# Altium schematic sheet Ethernet.SchDoc
size B
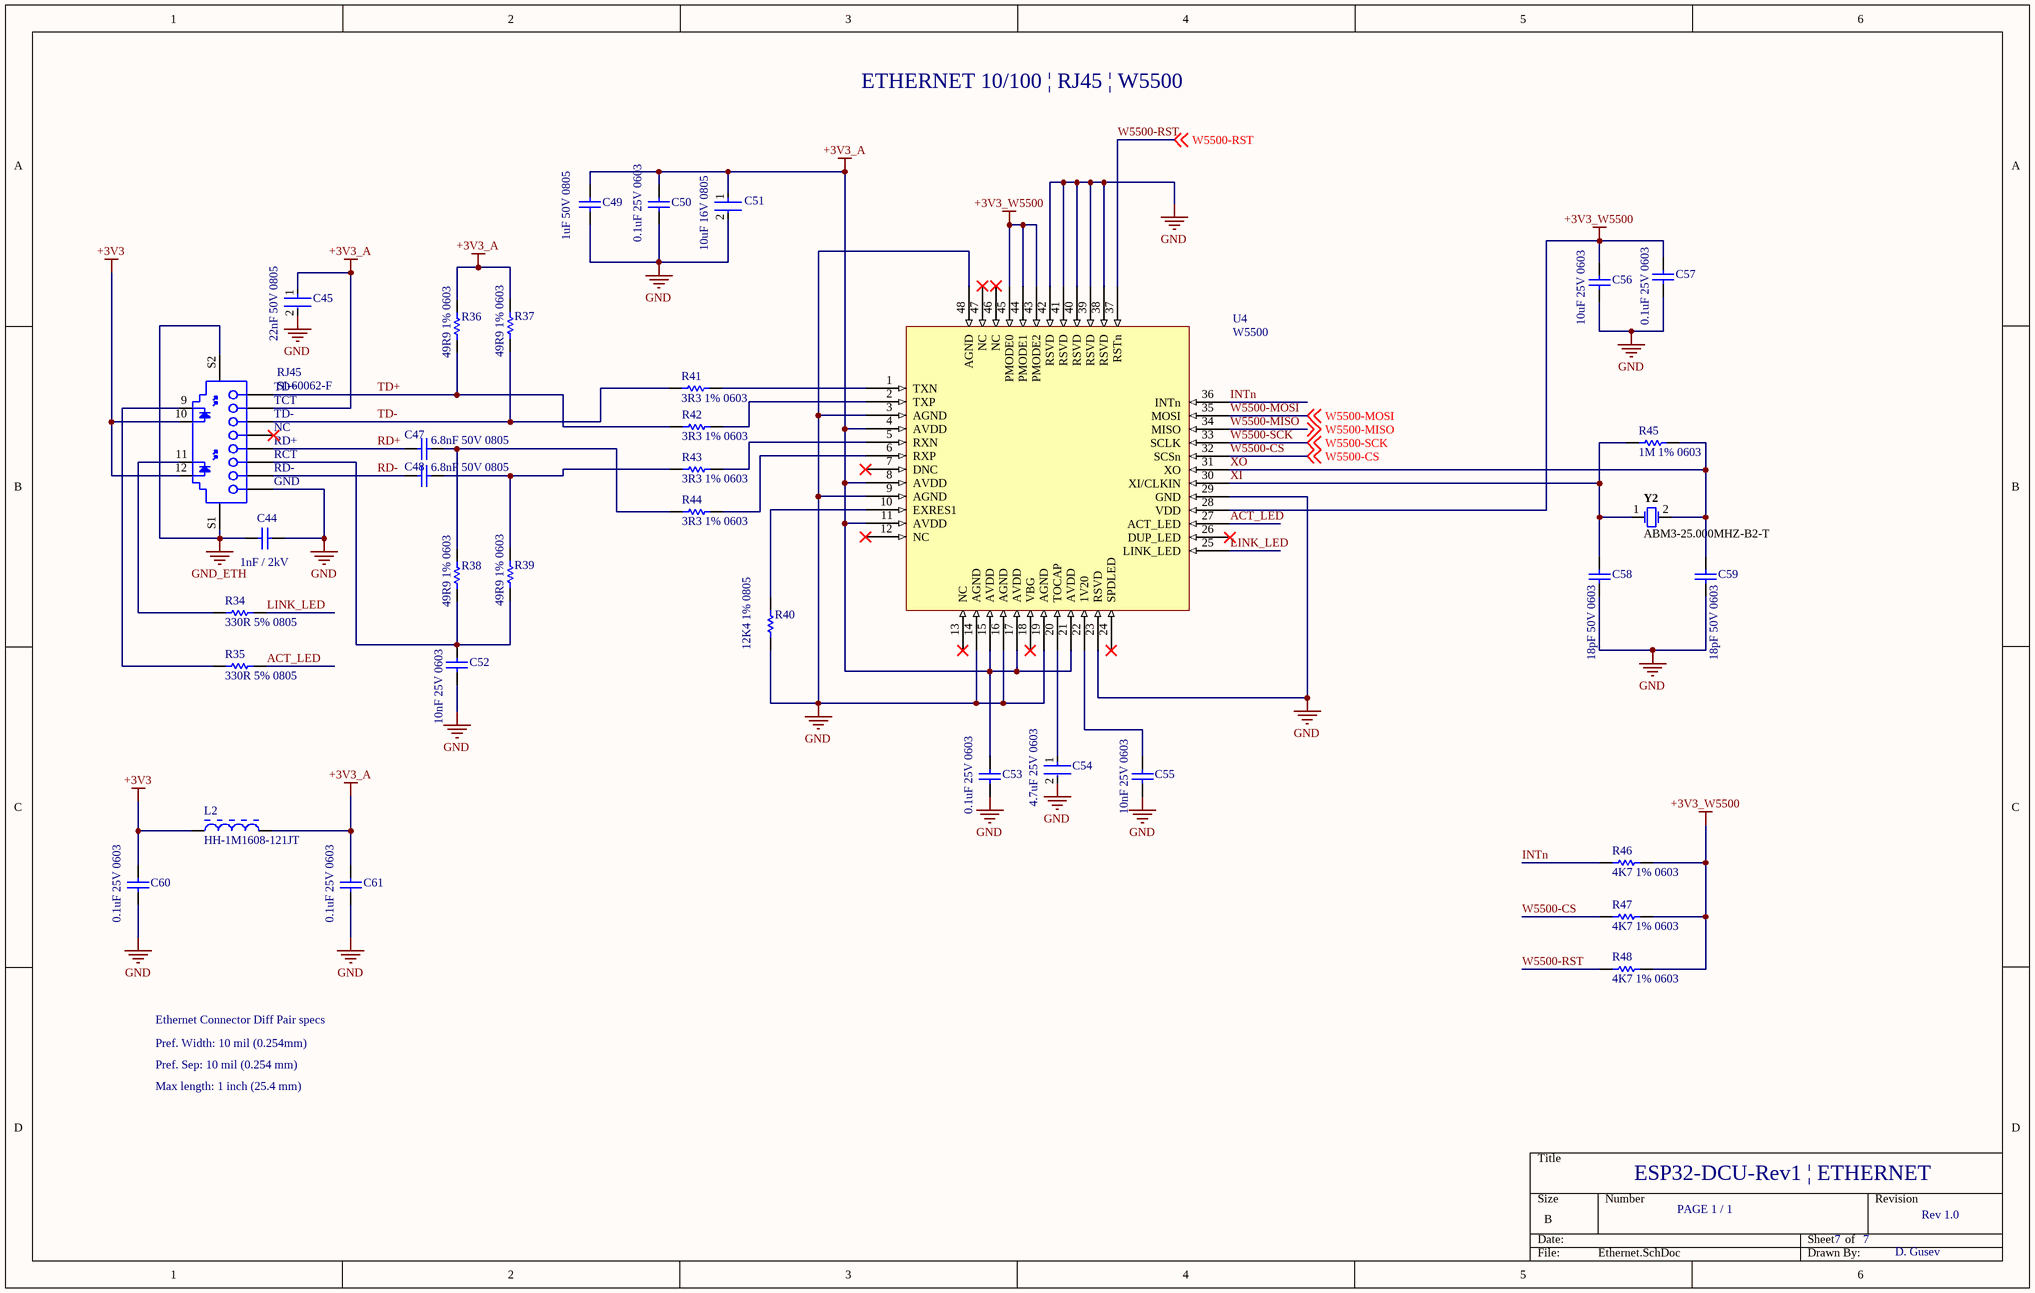
[diagram p0: Ethernet.SchDoc]

## Parts
C44  1nF / 2kV  [CAPC4532X155X60LL30T35]
C45  22nF 50V 0805  [FP-CL21-IPC_A]
C47  6.8nF 50V 0805  [CAPC2013X94X50NL20T25]
C48  6.8nF 50V 0805  [CAPC2013X94X50NL20T25]
C49  1uF 50V 0805  [CAPC2013X135X45LL10T25]
C50  0.1uF 25V 0603  [CAPC1608X90X35LL10T15]
C51  10uF 16V 0805  [FP-GRM21B-0_1-IPC_C]
C52  10nF 25V 0603  [CAPC1608X90X35NL15T15]
C53  0.1uF 25V 0603  [CAPC1608X90X35LL10T15]
C54  4.7uF 25V 0603  [FP-GRM188-0_15-IPC_C]
C55  10nF 25V 0603  [CAPC1608X90X35NL15T15]
C56  10uF 25V 0603  [CAPC1608X100X20VL10T10]
C57  0.1uF 25V 0603  [CAPC1608X90X35LL10T15]
C58  18pF 50V 0603  [CAPC1608X90X40LL10T20]
C59  18pF 50V 0603  [CAPC1608X90X40LL10T20]
C60  0.1uF 25V 0603  [CAPC1608X90X35LL10T15]
C61  0.1uF 25V 0603  [CAPC1608X90X35LL10T15]
L2  HH-1M1608-121JT  [CTC-1608_L]
R34  330R 5% 0805  [RESC2013X60X35LL10T20]
R35  330R 5% 0805  [RESC2013X60X35LL10T20]
R36  49R9 1% 0603  [RESC1608X55X25NL10T15]
R37  49R9 1% 0603  [RESC1608X55X25NL10T15]
R38  49R9 1% 0603  [RESC1608X55X25NL10T15]
R39  49R9 1% 0603  [RESC1608X55X25NL10T15]
R40  12K4 1% 0805  [RESC2013X60X35NL10T20]
R41  3R3 1% 0603  [RESC1608X55X25ML10T15]
R42  3R3 1% 0603  [RESC1608X55X25ML10T15]
R43  3R3 1% 0603  [RESC1608X55X25ML10T15]
R44  3R3 1% 0603  [RESC1608X55X25ML10T15]
R45  1M 1% 0603  [RESC1608X55X25LL10T15]
R46  4K7 1% 0603  [RESC1608X55X25LL10T15]
R47  4K7 1% 0603  [RESC1608X55X25LL10T15]
R48  4K7 1% 0603  [RESC1608X55X25LL10T15]
RJ45  SI-60062-F  [BELF-SI-60062-F_V]
U4  W5500  [W5500]
Y2  ABM3-25.000MHZ-B2-T  [ABRA-ABM3_V]

## Nets
+3V3: C60.2 L2.1 RJ45.10 RJ45.12
+3V3_A: C45.1 C49.2 C50.2 C51.1 C53.2 C61.2 L2.2 R36.2 R37.2 RJ45.2(TCT) U4.4(AVDD) U4.8(AVDD) U4.11(AVDD) U4.15(AVDD) U4.17(AVDD) U4.21(AVDD)
+3V3_W5500: C56.2 C57.2 R46.2 R47.2 R48.2 U4.28(VDD) U4.43(PMODE2) U4.44(PMODE1) U4.45(PMODE0)
GND: C44.2 C45.2 C49.1 C50.1 C51.2 C52.1 C53.1 C54.2 C55.1 C56.1 C57.1 C58.1 C59.1 C60.1 C61.1 R40.1 RJ45.8(GND) U4.3(AGND) U4.9(AGND) U4.14(AGND) U4.16(AGND) U4.19(AGND) U4.23(RSVD) U4.29(GND) U4.38(RSVD) U4.39(RSVD) U4.40(RSVD) U4.41(RSVD) U4.42(RSVD) U4.48(AGND)
GND_ETH: C44.1 RJ45.S1 RJ45.S2
ACT_LED: R35.2 U4.27(ACT_LED)
INTn: R46.1 U4.36(INTn)
LINK_LED: R34.2 U4.25(LINK_LED)
RD+: C47.1 RJ45.5(RD+)
RD-: C48.1 RJ45.7(RD-)
TD+: R36.1 R42.1 RJ45.1(TD+)
TD-: R37.1 R41.1 RJ45.3(TD-)
W5500-CS: R47.1 U4.32(SCSn) ; off-sheet W5500-CS
W5500-MISO: U4.34(MISO) ; off-sheet W5500-MISO
W5500-MOSI: U4.35(MOSI) ; off-sheet W5500-MOSI
W5500-RST: R48.1 U4.37(RSTn) ; off-sheet W5500-RST
W5500-SCK: U4.33(SCLK) ; off-sheet W5500-SCK
XI: C58.2 R45.1 U4.30(XI/CLKIN) Y2.1
XO: C59.2 R45.2 U4.31(XO) Y2.2
NetC47_2: C47.2 R38.2 R44.1
NetC48_2: C48.2 R39.2 R43.1
NetC52_2: C52.2 R38.1 R39.1 RJ45.6(RCT)
NetC54_1: C54.1 U4.20(TOCAP)
NetC55_2: C55.2 U4.22(1V20)
NetR34_1: R34.1 RJ45.11
NetR35_1: R35.1 RJ45.9
NetR40_2: R40.2 U4.10(EXRES1)
NetR41_2: R41.2 U4.1(TXN)
NetR42_2: R42.2 U4.2(TXP)
NetR43_2: R43.2 U4.5(RXN)
NetR44_2: R44.2 U4.6(RXP)

Not connected (* = marked no-connect by the designer): RJ45 4(NC)*; U4 7(DNC)* 12(NC)* 13(NC)* 18(VBG)* 24(SPDLED)* 26(DUP_LED)* 46(NC)* 47(NC)*

## Notes on the sheet
- ETHERNET 10/100 | RJ45 | W5500
- Ethernet Connector Diff Pair specs
- Pref. Width: 10 mil (0.254mm)
- Pref. Sep: 10 mil (0.254 mm)
- Max length: 1 inch (25.4 mm)
- ESP32-DCU-Rev1 | ETHERNET
- PAGE 1 / 1
- 7
- Rev 1.0
- D. Gusev

## Library data of the parts
C44 = CMP-2000-06032-1: Chip Capacitor, 1000 pF, +/- 10%, 2000 V, -55 to 125 degC, 1812 (4532 Metric), RoHS, Tape and Reel; Manufacturer: Kemet; Kits: 399-5086-ND-KITCERHI-VOLTAGECAPS; Catalog Drawings: ACTU_1812; Capacitance: 1000pF; Product Training Modules: CapacitorBasics-TypicalUsesforCapacitors; Online Catalog: X7RDielectricHighVoltage; Other Names: 399-3447-1; Temperature Coefficient: X7R; Voltage - Rated: 2000V(2kV); Family: CeramicCapacitors; Height - Seated (Max): -; Standard Package: 1; Size / Dimension: 0.177"Lx0.126"W(4.50mmx3.20mm); Datasheet URL: http://capacitoredge.kemet.com/capedge2/DataSheet/Datasheet-C1812C102KGRACTU.pdf?pn=C1812C102KGRACTU; Datasheet Version: 09/2016; Thickness (Max): 0.061"(1.55mm); Applications: SMPSFiltering; Package Description: 2-Pin Surface Mount Device, Body 4.5 x 3.2 mm; Package Reference: 1812; Mounting Technology: SurfaceMount; Packaging: CutTape(CT); Manufacturer URL: http://www.kemet.com/; Operating Temperature: -55°C~125°C; Mounting Type: SurfaceMount,MLCC; Features: HighVoltage; Package / Case: 1812(4532Metric); Lead Spacing: -; Tolerance: ±10%; Lead Style: -; Series: C; Category: Capacitors; Ratings: -
C45 = CMP-13271-002911-1: CL21 Series 0805 22nF 50V ±10% Tolerance X7R Multilayer Ceramic Chip Capacitor; Depth: 1.25mm; Thickness: 0.03inch; Height: 0.65mm; Material: Ceramic; Case/Package: 0805; Voltage Rating (DC): 50V; Contact Plating: Tin; Package Quantity: 1; Case Code (Metric): 2012; Max Operating Temperature: 125°C; Packaging: Tape and Reel; Voltage Rating: 50V; Radiation Hardening: No; Length: 2mm; Mount: Surface Mount; Min Operating Temperature: -55°C; Tolerance: 10%; Case Code (Imperial): 0805; Voltage: 50V; Capacitance: 22nF; Dielectric: X7R; Lead Free: Lead Free; Width: 0.049inch
C47 C48 = CMP-1036-03710-2: Manufacturer: AVX Interconnect / Elco; Part Number: 08055C682KAT2A
C49 = CMP-1036-04761-2: Manufacturer: Murata; Part Number: GRM21BR71H105KA12L
C50 C53 C57 C60 C61 = CMP-2006-02868-1: Part Number: GRM188R71E104KA01D; Manufacturer: Murata
C51 = CMP-2007-03453-2: Chip Multilayer Ceramic Capacitors for General Purpose, 0805, 10uF, X5R, 15%, 10%, 16V; Radiation Hardening: No; Thickness: 0.053inch; Voltage Rating (DC): 16V; Lead Free: Lead Free; Package Quantity: 1; Width: 1.25mm; Case Code (Imperial): 0805; Depth: 1.25mm; Packaging: Tape and Reel; Dielectric: X5R; Max Operating Temperature: 85°C; Tolerance: 10%; Voltage Rating: 16V; Voltage: 16V; Capacitance: 10uF; Height: 1.25mm; Case Code (Metric): 2012; Material: Ceramic; Mount: Surface Mount; Case/Package: 0805; REACH SVHC: No SVHC; Length: 2mm; Min Operating Temperature: -55°C; Termination: SMD/SMT
C52 C55 = CMP-2006-04155-1: Part Number: 06033C103KAT2A; Manufacturer: AVX Interconnect / Elco
C54 = CMP-2006-02523-2: Chip Multilayer Ceramic Capacitors for General Purpose, 0603, 4.7uF, X5R, 15%, 10%, 25V; Case Code (Metric): 1608; Max Operating Temperature: 85°C; REACH SVHC: No SVHC; Voltage Rating: 25V; Dielectric: X5R; Packaging: Cut Tape; Width: 0.031inch; Min Operating Temperature: -55°C; Lead Free: Lead Free; Capacitance: 4.7uF; Height: 0.8mm; Case Code (Imperial): 0603; Length: 1.6mm; Voltage Rating (DC): 25V; Case/Package: 0603; Voltage: 25V; Tolerance: 10%; Thickness: 0.031inch; Mount: Surface Mount; Material: Ceramic; Package Quantity: 4000; Depth: 0.8mm
C56 = CMP-2000-05442-1: Chip Capacitor, 10 uF, +/- 20%, 25 V, -55 to 85 degC, 0603 (1608 Metric), RoHS, Tape and Reel; Manufacturer: TDK; PCN Part Number: MLCCPartNumberChange30/Nov/2012; Other Names: 445-9015-1; Capacitance: 10µF; Design Resources: 20WNon-IsolatedBuckLEDDriverUsingPLLNK460KG; Kits: 445-9014-KIT-ND-KITMLCC100PF-22UF060310-50V; Product Training Modules: SEAT,CCV,andTVCLDesignToolsGuidetoReplacinganElectrolyticCapacitorwithanMLCC; Online Catalog: CSeries,GeneralPurpose; Temperature Coefficient: X5R; Package Description: 2-Pin Surface Mount Device, Body 1.6 x 0.8 mm; Lead Style: -; Datasheet URL: http://download.siliconexpert.com/pdfs/2016/2/22/9/40/35/949/tdk_/manual/8010476609961980104703407078c1608x5r1e106m080ac.pdf.pdf; Category: Capacitors; Package / Case: 0603(1608Metric); Packaging: CutTape(CT); Series: C; Features: -; Family: CeramicCapacitors; Standard Package: 1; Tolerance: ±20%; Operating Temperature: -55degC~85degC; Mounting Type: SurfaceMount,MLCC; Ratings: -; Size / Dimension: 0.063"Lx0.031"W(1.60mmx0.80mm); Applications: GeneralPurpose; Package Reference: 1608; RoHS Information: RoHSCertificate-MLCC; Manufacturer URL: http://www.tdk.com/; Datasheet Version: Feb-16; Voltage - Rated: 25V; Height - Seated (Max): -; Thickness (Max): 0.039"(1.00mm); Lead Spacing: -
C58 C59 = CMP-1659-00030-1: Chip Capacitor, 18 pF, +/- 5%, 50 V, -55 to 125 degC, 0603 (1608 Metric), RoHS, Tape and Reel; Case\Package: 0603; Power Rating: 100 mW; Resistance: 68.1 Ohm; Tolerance: 1%; Case Code (Metric): 1608; Max Operating Temperature: 155 degC; RoHSCompliant: true; Case Code (Imperial): 0603; Voltage Rating: 50 V; ComponentLink2Description: Datasheet; Package Quantity: 200; PackageReference: 0603; ComponentLink2URL: http://www.yageo.com/NewPortal/yageodocoutput?fileName=/pdf/MLCC/UPY-GP_NP0_16V-to-50V_14.pdf; Length: 1.6 mm; DatasheetVersion: Rev. 14, 07/2016; Min Operating Temperature: -55 degC; ComponentLink1URL: http://www.yageo.com/; Width: 0.8 mm; ComponentLink1Description: Manufacturer URL; Height: 0.45 mm; Radiation Hardening: No; PackageDescription: 2-Pin Surface Mount Device, Body 1.6 x 0.8 mm; Packaging: Tape and Reel
L2 = CMP-2000-06403-1: Chip Ferrite Bead, 0.14 Ohm, 1.1 A, -55 to 125 degC, 2-Pin SMD, RoHS, Tape and Reel; Manufacturer: CTC Coils; DC Resistance Max: 140MOhm; DC Current Max: 1.1A; Datasheet Version: 07/2004; Datasheet URL: http://data.icbank.com/ICBShop/board/beadhbm.pdf; PartNumber: HH-1M1608; Package Reference: 1608; Temperature Min: -55degC; Manufacturer URL: http://www.brokerforum.com/components-parts/CTCCoils-e-en.jsa; Mounting Technology: SurfaceMount; Temperature Max: 125degC; Package Description: 2-Pin Surface Mount Device, Body 1.6 x 0.8 mm; Packing: TapeandReel
R34 R35 = CMP-2000-06960-1: Chip Resistor, 330 Ohm, +/- 1%, 125 mW, -55 to 155 degC, 0805 (2012 Metric), RoHS, Tape and Reel; Manufacturer: Yageo; Voltage Rating: 150V; Temperature Coefficient: 100PPM/C; Power Rating: 125mW(1/8W); Resistance: 330Ohms; Datasheet Version: Rev. 7, 05/2017; Termination Style: SMD/SMT; Case Code - mm: 2012; Package Description: 2-Pin Surface Mounted Device, Body 2 x 1.25 mm; Operating Temperature Range: -55Cto+155C; Case Code - in: 0805; Packaging: Reel; Tolerance: 1%; Package Reference: 0805; Mounting Technology: SurfaceMount; Product: ThickFilmResistorsGeneralPurpose; Series: RC; Manufacturer URL: http://www.yageo.com/; Datasheet URL: http://www.yageo.com/documents/recent/PYu-RC_Group_51_RoHS_L_7.pdf
R36-R39 = CMP-1659-00036-1: General Purpose Chip Resistor, 49.9 Ohm, +/- 1%, -55 to 155 degC, 0603 (1608 Metric), RoHS, Tape and Reel; Max Supply Voltage: 3.63 V; Case\Package: LQFP; Interface: SPI; Min Supply Voltage: 2.97 V; PackageReference: 0603; Packaging: Tray; ComponentLink2Description: Datasheet; ComponentLink1Description: Manufacturer URL; ComponentLink2URL: https://datasheet.ciiva.com/11808/0900766b80f96399-11808223.pdf; RoHSCompliant: true; Max Operating Temperature: 85 degC; ComponentLink1URL: http://www.yageo.com/; PackageDescription: 2-Pin Surface Mount Device, Body 1.6 x 0.8 mm; DatasheetVersion: Rev. 4, 04/2009; Min Operating Temperature: -40 degC; Package Quantity: 250; Pins: 48
R40 = CMP-2001-00911-1: Part Number: RC0805FR-0712K4L; Manufacturer: Yageo
R41-R44 = CMP-2000-04272-1: Part Number: RC0603JR-073R3L; Manufacturer: Yageo
R45 = CMP-2000-04829-1: Manufacturer: Yageo; Part Number: AC0603FR-071ML
R46-R48 = CMP-2000-06942-1: Chip Resistor, 4.7 KOhm, +/- 1%, 0.1 W, -55 to 155 degC, 0603 (1608 Metric), RoHS, Tape and Reel; Manufacturer: Yageo; Power Rating: 100mW; Temperature Coefficient: 100PPM/C; Resistance: 4.7kOhms; Voltage Rating: 50V; Package Reference: 0603; Series: RC; Datasheet Version: Rev. 7, 05/2017; Packaging: Reel; Termination Style: SMD/SMT; Datasheet URL: http://www.yageo.com/documents/recent/PYu-RC_Group_51_RoHS_L_7.pdf; Manufacturer URL: http://www.yageo.com/; Package Description: 2-Pin Surface Mount Device, Body 1.6 x 0.8 mm; Case Code - mm: 1608; Case Code - in: 0603; Mounting Technology: SurfaceMount; Operating Temperature Range: -55Cto+155C; Tolerance: 1%; Product: ThickFilmResistorsGeneralPurpose
RJ45 = CMP-2000-07059-1: 1 Port RJ45 Magjack Connector with Yellow and Green LED, 10/100 Base-T, 12-Pin THD, RoHS, Tray; Manufacturer: Bel Fuse; Number of Ways: 8P4C; Gender: Female; Shield Type: STP; Connector Type: RJ45; Contact Plating: Gold; Mounting Type: ThroughHole; Datasheet Version: Rev. B0, 09/2008; Package Reference: SI-60062-F; Manufacturer URL: http://belfuse.com/; Package Description: 12-Pin Through Hole Device, Body 21.59 x 16.13 mm; Series: MagJack; Contact Material: CopperAlloy; Datasheet URL: http://belfuse.com/pdfs/SI-60062-F.pdf; Width: 17.98mm; Length: 15.21mm; Mounting Technology: ThroughHole; Depth: 21.59mm; Orientation: Straight
U4 = W5500: W5500 10/100 ETHERNET
Y2 = CMP-2000-05729-1: Miniature Ceramic Crystal, 25 MHz, +/- 20 ppm, -20 to 70 degC, 2-Pin SMD, RoHS, Tape and Reel; Manufacturer: ABRACON; Case Height: 1.3mm; Tolerance: 20PPM; Load Capacitance: 18pF; Frequency: 25MHz; ESR: 30Ohms; Frequency Stability: 50PPM; Case Width: 3.2mm; Case Length: 5mm; Packaging: Reel; Package Description: 2-Pin Surface Mount Device, Body 5 x 3.2 mm; Manufacturer URL: http://www.abracon.com/; Mounting Technology: SurfaceMount; RoHS: Details; Operating Temperature Range: -20Cto+70C; Datasheet URL: http://www.abracon.com/Resonators/abm3.pdf; Type: MiniatureCeramicCrystal; Series: ABM3; Product Category: Crystals; Factory Pack Quantity: 1000; Mounting Style: SMD/SMT; Brand: ABRACON; Datasheet Version: 09/2013; Dimensions: 3.2mmWx5mmLx1.3mmH; Termination Style: SMD/SMT; Package Reference: ABM3; Package / Case: 5mmx3.2mm